# EAGLE design JAE_Extender (EAGLE 9.2.0)
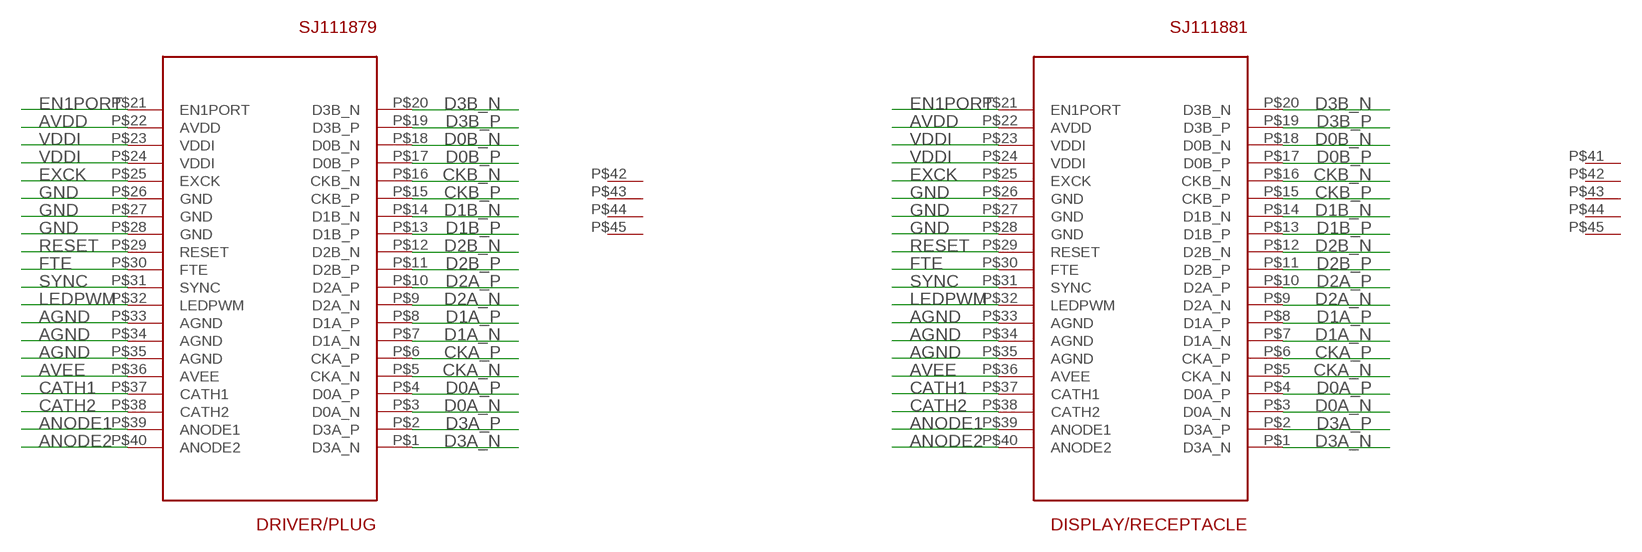
[diagram p0: schematic, sheet 1]

## Parts
DISPLAY/RECEPTACLE  SJ111881  [SJ111881]
DRIVER/PLUG  SJ111879  [SJ111879]

## Nets
AGND: DISPLAY/RECEPTACLE.P$33(AGND) DISPLAY/RECEPTACLE.P$34(AGND) DISPLAY/RECEPTACLE.P$35(AGND) DRIVER/PLUG.P$33(AGND) DRIVER/PLUG.P$34(AGND) DRIVER/PLUG.P$35(AGND)
ANODE1: DISPLAY/RECEPTACLE.P$39(ANODE1) DRIVER/PLUG.P$39(ANODE1)
ANODE2: DISPLAY/RECEPTACLE.P$40(ANODE2) DRIVER/PLUG.P$40(ANODE2)
AVDD: DISPLAY/RECEPTACLE.P$22(AVDD) DRIVER/PLUG.P$22(AVDD)
AVEE: DISPLAY/RECEPTACLE.P$36(AVEE) DRIVER/PLUG.P$36(AVEE)
CATH1: DISPLAY/RECEPTACLE.P$37(CATH1) DRIVER/PLUG.P$37(CATH1)
CATH2: DISPLAY/RECEPTACLE.P$38(CATH2) DRIVER/PLUG.P$38(CATH2)
CKA_N: DISPLAY/RECEPTACLE.P$5(CKA_N) DRIVER/PLUG.P$5(CKA_N)
CKA_P: DISPLAY/RECEPTACLE.P$6(CKA_P) DRIVER/PLUG.P$6(CKA_P)
CKB_N: DISPLAY/RECEPTACLE.P$16(CKB_N) DRIVER/PLUG.P$16(CKB_N)
CKB_P: DISPLAY/RECEPTACLE.P$15(CKB_P) DRIVER/PLUG.P$15(CKB_P)
D0A_N: DISPLAY/RECEPTACLE.P$3(D0A_N) DRIVER/PLUG.P$3(D0A_N)
D0A_P: DISPLAY/RECEPTACLE.P$4(D0A_P) DRIVER/PLUG.P$4(D0A_P)
D0B_N: DISPLAY/RECEPTACLE.P$18(D0B_N) DRIVER/PLUG.P$18(D0B_N)
D0B_P: DISPLAY/RECEPTACLE.P$17(D0B_P) DRIVER/PLUG.P$17(D0B_P)
D1A_N: DISPLAY/RECEPTACLE.P$7(D1A_N) DRIVER/PLUG.P$7(D1A_N)
D1A_P: DISPLAY/RECEPTACLE.P$8(D1A_P) DRIVER/PLUG.P$8(D1A_P)
D1B_N: DISPLAY/RECEPTACLE.P$14(D1B_N) DRIVER/PLUG.P$14(D1B_N)
D1B_P: DISPLAY/RECEPTACLE.P$13(D1B_P) DRIVER/PLUG.P$13(D1B_P)
D2A_N: DISPLAY/RECEPTACLE.P$9(D2A_N) DRIVER/PLUG.P$9(D2A_N)
D2A_P: DISPLAY/RECEPTACLE.P$10(D2A_P) DRIVER/PLUG.P$10(D2A_P)
D2B_N: DISPLAY/RECEPTACLE.P$12(D2B_N) DRIVER/PLUG.P$12(D2B_N)
D2B_P: DISPLAY/RECEPTACLE.P$11(D2B_P) DRIVER/PLUG.P$11(D2B_P)
D3A_N: DISPLAY/RECEPTACLE.P$1(D3A_N) DRIVER/PLUG.P$1(D3A_N)
D3A_P: DISPLAY/RECEPTACLE.P$2(D3A_P) DRIVER/PLUG.P$2(D3A_P)
D3B_N: DISPLAY/RECEPTACLE.P$20(D3B_N) DRIVER/PLUG.P$20(D3B_N)
D3B_P: DISPLAY/RECEPTACLE.P$19(D3B_P) DRIVER/PLUG.P$19(D3B_P)
EN1PORT: DISPLAY/RECEPTACLE.P$21(EN1PORT) DRIVER/PLUG.P$21(EN1PORT)
EXCK: DISPLAY/RECEPTACLE.P$25(EXCK) DRIVER/PLUG.P$25(EXCK)
FTE: DISPLAY/RECEPTACLE.P$30(FTE) DRIVER/PLUG.P$30(FTE)
GND: DISPLAY/RECEPTACLE.P$26(GND) DISPLAY/RECEPTACLE.P$27(GND) DISPLAY/RECEPTACLE.P$28(GND) DRIVER/PLUG.P$26(GND) DRIVER/PLUG.P$27(GND) DRIVER/PLUG.P$28(GND)
LEDPWM: DISPLAY/RECEPTACLE.P$32(LEDPWM) DRIVER/PLUG.P$32(LEDPWM)
RESET: DISPLAY/RECEPTACLE.P$29(RESET) DRIVER/PLUG.P$29(RESET)
SYNC: DISPLAY/RECEPTACLE.P$31(SYNC) DRIVER/PLUG.P$31(SYNC)
VDDI: DISPLAY/RECEPTACLE.P$23(VDDI) DISPLAY/RECEPTACLE.P$24(VDDI) DRIVER/PLUG.P$23(VDDI) DRIVER/PLUG.P$24(VDDI)

## Power pins joined to a net without a drawn wire
GND: DISPLAY/RECEPTACLE.P$41(GND) DISPLAY/RECEPTACLE.P$42(GND) DISPLAY/RECEPTACLE.P$43(GND) DISPLAY/RECEPTACLE.P$44(GND) DISPLAY/RECEPTACLE.P$45(GND) DRIVER/PLUG.P$42(GND) DRIVER/PLUG.P$43(GND) DRIVER/PLUG.P$44(GND) DRIVER/PLUG.P$45(GND)

## Library data of the parts
DISPLAY/RECEPTACLE = ProjectNorthStar:SJ111881: Outer Shell http://www.jae.com/z-en/pdf_download_exec.cfm?param=SJ111881.pdf
DRIVER/PLUG = ProjectNorthStar:SJ111879: Inner receptacle http://www.jae.com/z-en/pdf_download_exec.cfm?param=SJ111879.pdf

## Board
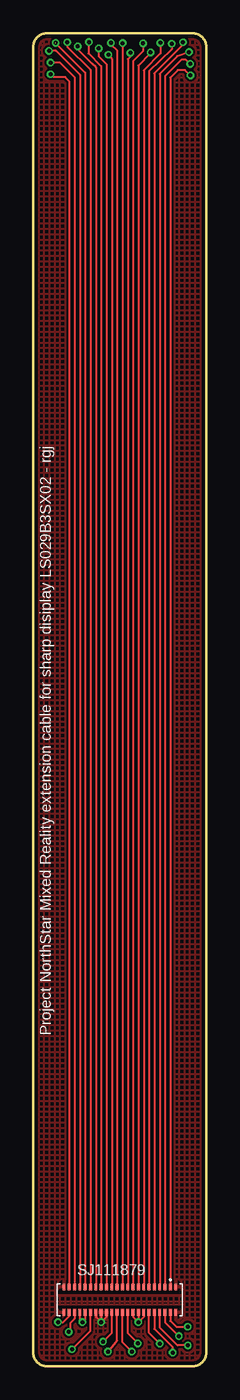
[diagram p1: board, top side]
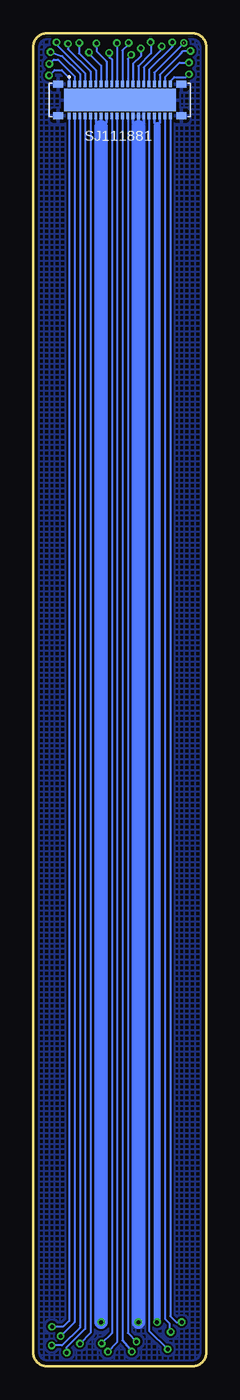
[diagram p2: board, bottom side, seen from below]

Size 13 x 100 mm. Coordinates in mm from the lower left corner, seen from the top.
Outline: 1,0 12,0 arc90 13,1 13,99 arc90 12,100 1,100 arc90 0,99 0,1 arc90 1,0
Copper layers (1*16): Top 0.0178mm / dielectric 12mil / Bottom 0.0178mm
Design rules "SSC-EAGLE-4Lyr_v1.0.0.3 *": minimum track width 6mil, minimum drill 10mil, track to track 6mil, track to pad 6mil, pad to pad 6mil, via to via 6mil, smd to smd 6mil, copper to edge 10mil, drill to drill 8mil, minimum pad ring 10mil, minimum via ring 5mil, stop-mask expansion 3mil, vias tented up to drill 40mil, thermal gap 10mil

### Footprints (pad centres in the part's own frame; a part is rotated, then mirrored left to right if it is on the bottom)
SJ111881 = smd 0.22 x 0.5: P$1 -3.8,1.2; P$2 -3.4,1.2; P$3 -3,1.2; P$4 -2.6,1.2; P$5 -2.2,1.2; P$6 -1.8,1.2; P$7 -1.4,1.2; P$8 -1,1.2; P$9 -0.6,1.2; P$10 -0.2,1.2; P$11 0.2,1.2; P$12 0.6,1.2; P$13 1,1.2; P$14 1.4,1.2; P$15 1.8,1.2; P$16 2.2,1.2; P$17 2.6,1.2; P$18 3,1.2; P$19 3.4,1.2; P$20 3.8,1.2; P$21 3.8,-1.2; P$22 3.4,-1.2; P$23 3,-1.2; P$24 2.6,-1.2; P$25 2.2,-1.2; P$26 1.8,-1.2; P$27 1.4,-1.2; P$28 1,-1.2; P$29 0.6,-1.2; P$30 0.2,-1.2; P$31 -0.2,-1.2; P$32 -0.6,-1.2; P$33 -1,-1.2; P$34 -1.4,-1.2; P$35 -1.8,-1.2; P$36 -2.2,-1.2; P$37 -2.6,-1.2; P$38 -3,-1.2; P$39 -3.4,-1.2; P$40 -3.8,-1.2 | smd 8.4 x 1.7: P$41 0,0 | smd 0.75 x 0.55: P$42 4.625,-1.175; P$43 -4.625,-1.175; P$44 -4.625,1.175; P$45 4.625,1.175
SJ111879 = smd 0.22 x 0.5: P$1 3.8,0.95; P$2 3.4,0.95; P$3 3,0.95; P$4 2.6,0.95; P$5 2.2,0.95; P$6 1.8,0.95; P$7 1.4,0.95; P$8 1,0.95; P$9 0.6,0.95; P$10 0.2,0.95; P$11 -0.2,0.95; P$12 -0.6,0.95; P$13 -1,0.95; P$14 -1.4,0.95; P$15 -1.8,0.95; P$16 -2.2,0.95; P$17 -2.6,0.95; P$18 -3,0.95; P$19 -3.4,0.95; P$20 -3.8,0.95; P$21 -3.8,-0.95; P$22 -3.4,-0.95; P$23 -3,-0.95; P$24 -2.6,-0.95; P$25 -2.2,-0.95; P$26 -1.8,-0.95; P$27 -1.4,-0.95; P$28 -1,-0.95; P$29 -0.6,-0.95; P$30 -0.2,-0.95; P$31 0.2,-0.95; P$32 0.6,-0.95; P$33 1,-0.95; P$34 1.4,-0.95; P$35 1.8,-0.95; P$36 2.2,-0.95; P$37 2.6,-0.95; P$38 3,-0.95; P$39 3.4,-0.95; P$40 3.8,-0.95; P$42 4.2,-0.95; P$43 -4.2,-0.95; P$44 -4.2,0.95; P$45 4.2,0.95

### Placement (x,y rotation side)
DISPLAY/RECEPTACLE  6.5,95 0 bottom
DRIVER/PLUG  6.5,5 0 top

### Tracks (layer width: path | path; a pad name or v marks a point on that pad's centre or on a via)
AGND  (via drill 0.3)
  Top 0.152: DRIVER/PLUG.P$33 7.5,3.7 v7.9,3.3 | DRIVER/PLUG.P$34 v7.9,3.3 | DRIVER/PLUG.P$35 8.3,3.7 v7.9,3.3
  Bottom 0.2: DISPLAY/RECEPTACLE.P$34 7.9,93 | 7.9,93 7.9,92.94 7.5,93.34 DISPLAY/RECEPTACLE.P$33 | DISPLAY/RECEPTACLE.P$35 8.3,93.33 7.9,93
  Bottom 1.016: 7.9,93 v7.9,3.3
ANODE1  (via drill 0.3)
  Top 0.152: DRIVER/PLUG.P$39 9.9,3.3 v10.94,2.26
  Bottom 0.152: DISPLAY/RECEPTACLE.P$39 9.9,3.3 v10.94,2.26
ANODE2  (via drill 0.3 pad 0.55)
  Top 0.152: v11.6,2.96 10.74,2.96 10.3,3.4 DRIVER/PLUG.P$40
  Bottom 0.152: DISPLAY/RECEPTACLE.P$40 10.3,3.4 10.74,2.96 v11.6,2.96
AVDD  (via drill 0.3)
  Top 0.152: DRIVER/PLUG.P$22 3.1,3.56 2.77,3.23 2.77,2.67 v2.67,2.57
  Bottom 0.152: DISPLAY/RECEPTACLE.P$22 3.1,3.56 2.77,3.23 2.77,2.67 v2.67,2.57
AVEE  (via drill 0.3)
  Top 0.152: v9.5,1.7 8.7,2.5 8.7,4.04 DRIVER/PLUG.P$36
  Bottom 0.152: DISPLAY/RECEPTACLE.P$36 8.7,2.5 v9.5,1.7
CATH1  (via drill 0.3)
  Top 0.152: v10.48,1.02 10.48,1.42 9.1,2.8 DRIVER/PLUG.P$37
  Bottom 0.152: DISPLAY/RECEPTACLE.P$37 9.1,2.8 10.48,1.42 v10.48,1.02
CATH2  (via drill 0.3)
  Top 0.152: v11.62,1.56 10.84,1.56 9.5,2.9 9.5,3.06 DRIVER/PLUG.P$38
  Bottom 0.152: DISPLAY/RECEPTACLE.P$38 9.5,3.06 9.5,2.9 10.84,1.56 v11.62,1.56
CKA_N  (via drill 0.3)
  Top 0.152: DRIVER/PLUG.P$5 8.7,97.14 10.4,98.82 v10.4,99.22
  Bottom 0.152: DISPLAY/RECEPTACLE.P$5 8.7,96.21 8.7,97.14 10.4,98.82 v10.4,99.22
CKA_P  (via drill 0.3)
  Top 0.152: DRIVER/PLUG.P$6 8.3,97.23 9.57,98.5 9.57,99.25 v9.54,99.28
  Bottom 0.152: DISPLAY/RECEPTACLE.P$6 8.3,96.23 8.3,97.23 9.57,98.5 9.57,99.28 v9.54,99.28
CKB_N  (via drill 0.3)
  Top 0.152: DRIVER/PLUG.P$16 4.3,97.26 2.56,99 v2.56,99.33
  Bottom 0.152: DISPLAY/RECEPTACLE.P$16 4.3,97.26 2.56,99 v2.56,99.33
CKB_P  (via drill 0.3)
  Top 0.152: DRIVER/PLUG.P$15 4.7,97.44 4.43,97.71 3.34,98.8 v3.34,99.02
  Bottom 0.152: DISPLAY/RECEPTACLE.P$15 4.7,97.44 4.43,97.71 3.34,98.8 v3.34,99.02
D0A_N  (via drill 0.3)
  Top 0.152: v11.71,98.59 10.82,98.29 9.5,96.96 DRIVER/PLUG.P$3
  Bottom 0.152: DISPLAY/RECEPTACLE.P$3 9.5,96.96 10.82,98.29 v11.71,98.59
D0A_P  (via drill 0.3)
  Top 0.152: v11.25,99.33 11.24,99.13 9.1,97 DRIVER/PLUG.P$4
  Bottom 0.152: DISPLAY/RECEPTACLE.P$4 9.1,97 11.24,99.13 v11.25,99.33
D0B_N  (via drill 0.3)
  Top 0.152: DRIVER/PLUG.P$18 3.5,96.88 1.7,98.68 v1.18,98.68
  Bottom 0.152: DISPLAY/RECEPTACLE.P$18 3.5,96.88 1.94,98.44 1.7,98.68 v1.18,98.68
D0B_P  (via drill 0.3)  (1 unrouted)
  Top 0.152: DRIVER/PLUG.P$17 3.9,97.05 1.68,99.27 | DRIVER/PLUG.P$17 3.9,5.91 DRIVER/PLUG.P$17
  Bottom 0.102: v1.68,99.29 1.69,99.26
  Bottom 0.152: DISPLAY/RECEPTACLE.P$17 3.9,97.05 1.69,99.26
D1A_N  (via drill 0.3)
  Top 0.152: DRIVER/PLUG.P$7 7.9,97.58 8.82,98.49 v8.82,98.57
  Bottom 0.102: 8.82,98.49 8.72,98.39
  Bottom 0.152: DISPLAY/RECEPTACLE.P$7 7.9,97.57 8.72,98.39 | v8.82,98.57 8.82,98.49
D1A_P  (via drill 0.3)
  Top 0.152: DRIVER/PLUG.P$8 7.5,97.9 8.24,98.64 8.24,99.23 v8.25,99.24
  Bottom 0.152: DISPLAY/RECEPTACLE.P$8 7.5,97.9 8.24,98.64 8.24,99.23 v8.25,99.24
D1B_N  (via drill 0.3)
  Top 0.152: DRIVER/PLUG.P$14 5.1,97.55 4.15,98.5 4.15,99.31 v4.18,99.34
  Bottom 0.152: DISPLAY/RECEPTACLE.P$14 5.1,97.55 4.15,98.5 4.15,99.31 v4.18,99.34
D1B_P  (via drill 0.3)
  Top 0.152: DRIVER/PLUG.P$13 5.5,97.7 4.92,98.28 v4.92,98.87
  Bottom 0.152: DISPLAY/RECEPTACLE.P$13 5.5,97.7 4.92,98.28 v4.92,98.87
D2A_N  (via drill 0.3)
  Top 0.152: DRIVER/PLUG.P$9 7.1,98.06 7.29,98.25 v7.29,98.53
  Bottom 0.152: DISPLAY/RECEPTACLE.P$9 7.1,98.06 7.29,98.25 v7.29,98.53
D2A_P  (via drill 0.3)
  Top 0.102: v6.7,99.26 v6.71,99.27
  Top 0.152: v6.7,99.26 DRIVER/PLUG.P$10
  Bottom 0.102: v6.71,99.27 v6.7,99.27
  Bottom 0.152: v6.7,99.27 DISPLAY/RECEPTACLE.P$10
D2B_N  (via drill 0.3)
  Top 0.102: v5.65,98.39 5.62,98.36
  Top 0.152: 5.62,98.36 5.9,98.09 DRIVER/PLUG.P$12 | v5.65,98.39
  Bottom 0.152: DISPLAY/RECEPTACLE.P$12 5.9,98.08 5.62,98.36 v5.65,98.39
D2B_P  (via drill 0.3)
  Top 0.102: 5.86,99.16 5.83,99.19
  Top 0.152: 5.86,99.16 6.3,98.72 DRIVER/PLUG.P$11 | v5.83,99.29 5.83,99.19
  Bottom 0.102: 5.83,99.21 5.82,99.2
  Bottom 0.152: DISPLAY/RECEPTACLE.P$11 6.3,98.72 5.82,99.2 | v5.83,99.29 5.83,99.21
D3A_N  (via drill 0.3)
  Top 0.152: v11.82,96.84 11.41,97.25 10.86,97.25 10.3,96.68 DRIVER/PLUG.P$1
  Bottom 0.152: DISPLAY/RECEPTACLE.P$1 10.3,96.68 10.86,97.25 11.41,97.25 v11.82,96.84
D3A_P  (via drill 0.3)
  Top 0.152: v11.8,97.7 11.45,98.03 11.14,98.03 9.9,96.8 DRIVER/PLUG.P$2
  Bottom 0.152: DISPLAY/RECEPTACLE.P$2 9.9,96.8 10.85,97.75 11.14,98.03 11.45,98.03 v11.8,97.7
D3B_N  (via drill 0.3)
  Top 0.152: DRIVER/PLUG.P$20 2.7,96.4 2.4,96.71 1.53,96.71 v1.3,96.93
  Bottom 0.152: DISPLAY/RECEPTACLE.P$20 2.7,96.4 2.4,96.71 1.53,96.71 v1.3,96.93
D3B_P  (via drill 0.3)
  Top 0.152: DRIVER/PLUG.P$19 3.1,96.72 2.27,97.54 2.01,97.81 v1.3,97.81
  Bottom 0.152: DISPLAY/RECEPTACLE.P$19 3.1,96.72 2.27,97.54 2.01,97.81 v1.3,97.81
EN1PORT  (via drill 0.3)
  Top 0.152: DRIVER/PLUG.P$21 2.7,3.75 2.25,3.3 v1.85,3.3
  Bottom 0.152: DISPLAY/RECEPTACLE.P$21 2.7,3.75 2.25,3.3 v1.85,3.3
EXCK  (via drill 0.3)
  Top 0.152: v2.9,1.27 4.3,2.67 DRIVER/PLUG.P$25
  Bottom 0.152: DISPLAY/RECEPTACLE.P$25 4.3,2.67 v2.9,1.27
FTE  (via drill 0.3)
  Top 0.152: v5.6,1.1 6.3,1.94 DRIVER/PLUG.P$30
  Bottom 0.152: DISPLAY/RECEPTACLE.P$30 6.3,1.94 v5.6,1.1
GND  (via drill 0.3)
  Top 0.152: DRIVER/PLUG.P$26 4.7,3.7 v5.1,3.3 | DRIVER/PLUG.P$27 v5.1,3.3 | DRIVER/PLUG.P$28 5.5,3.7 v5.1,3.3
  Bottom 0.2: 5.1,93 5.1,93.2 4.7,93.2 DISPLAY/RECEPTACLE.P$26 | DISPLAY/RECEPTACLE.P$28 5.5,93.3 5.1,93 | DISPLAY/RECEPTACLE.P$27 5.1,93
  Bottom 1.016: 5.1,93 v5.1,3.3
  pour Top (hatched): 0,100 13,100 13,0 0,0
  pour Bottom (hatched): 0,100 13,100 13,0 0,0
LEDPWM  (via drill 0.3)
  Top 0.152: v7.86,1.71 7.1,2.47 DRIVER/PLUG.P$32
  Bottom 0.152: DISPLAY/RECEPTACLE.P$32 7.1,2.47 v7.86,1.71
RESET  (via drill 0.3)
  Top 0.152: v5.24,1.84 5.9,2.5 DRIVER/PLUG.P$29
  Bottom 0.152: DISPLAY/RECEPTACLE.P$29 5.9,2.5 v5.24,1.84
SYNC  (via drill 0.3)
  Top 0.152: v7.4,1.1 6.7,1.8 DRIVER/PLUG.P$31
  Bottom 0.152: DISPLAY/RECEPTACLE.P$31 6.7,1.8 v7.4,1.1
VDDI  (via drill 0.3)
  Top 0.152: DRIVER/PLUG.P$23 3.5,3.5 v3.7,3.3 3.9,3.5 DRIVER/PLUG.P$24
  Bottom 0.102: 3.5,3.5 v3.7,3.3 3.9,3.5
  Bottom 0.2: DISPLAY/RECEPTACLE.P$23 3.5,93.3 3.7,93.1 3.9,93.3 DISPLAY/RECEPTACLE.P$24
  Bottom 0.508: 3.7,93.1 v3.7,3.3

### Text on the board
tNames: Project NorthStar Mixed Reality extension cable for sharp disiplay LS029B3SX02 - rgj | SJ111879
bNames: SJ111881